# EAGLE board NHK2016mother_rev4 (EAGLE 6.2)
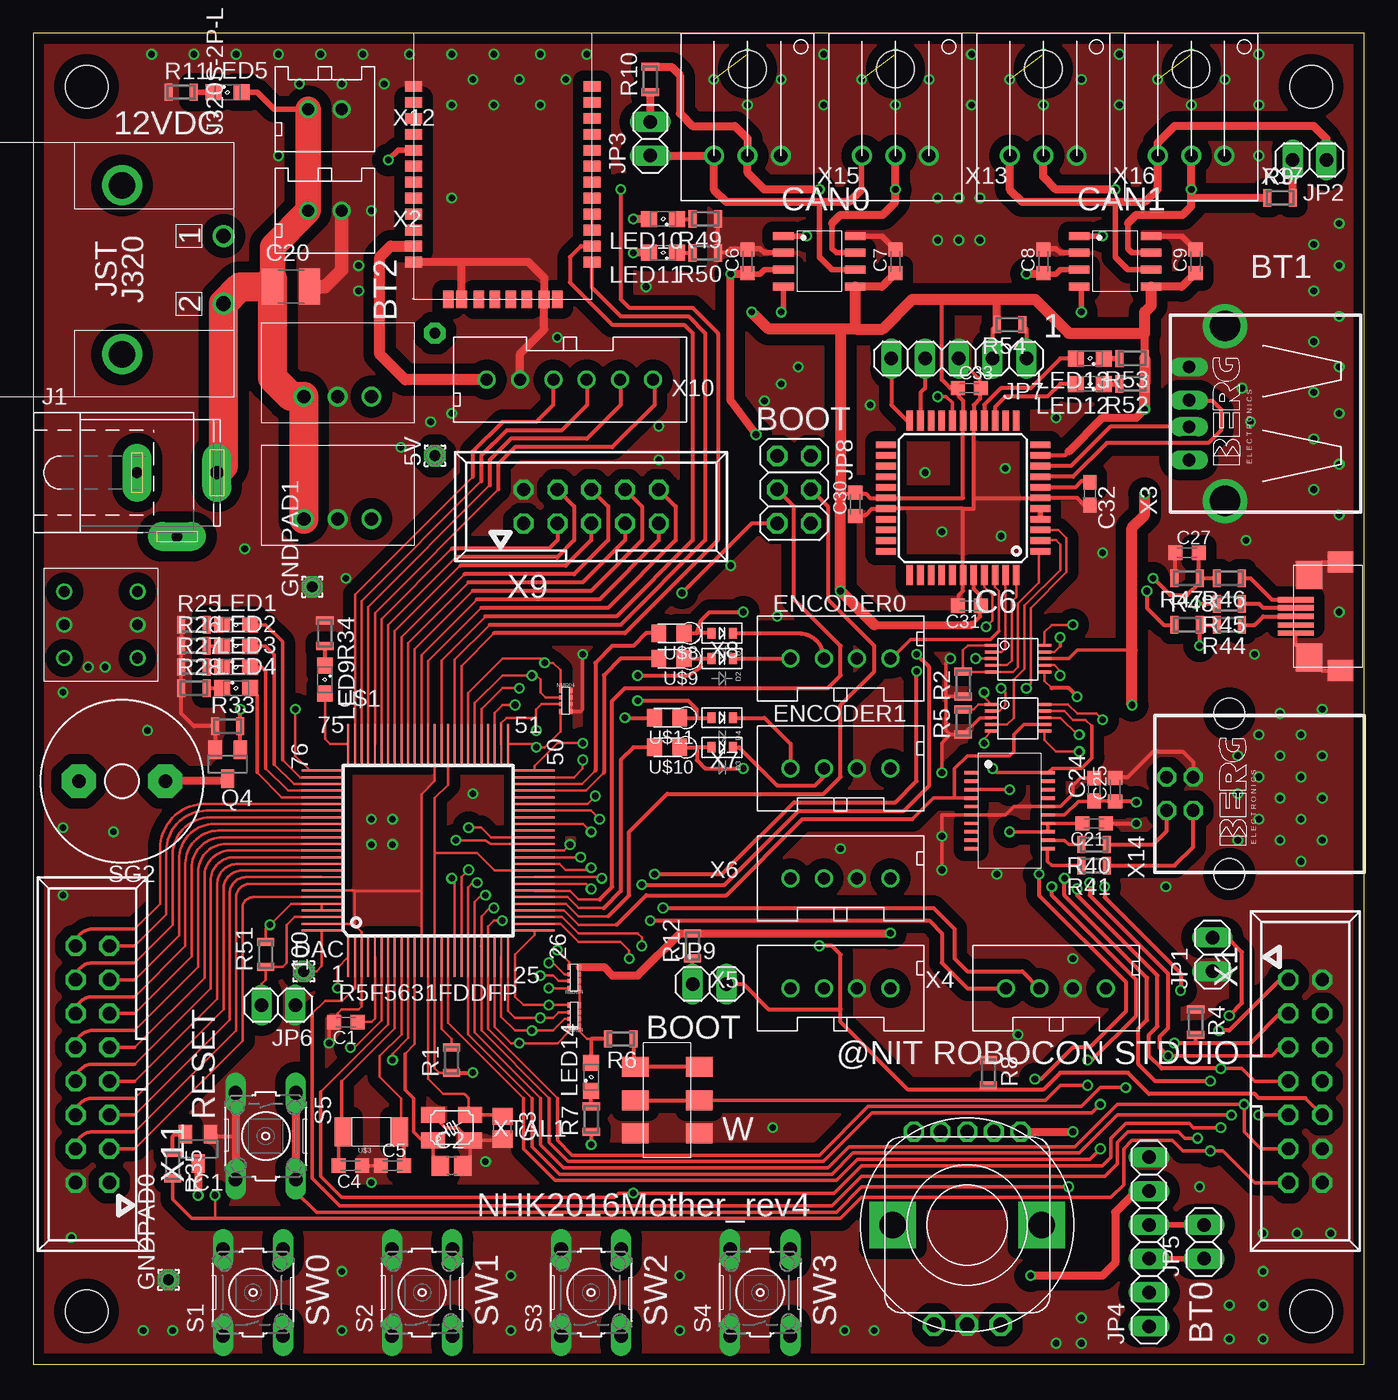
[diagram p2: board, top side]
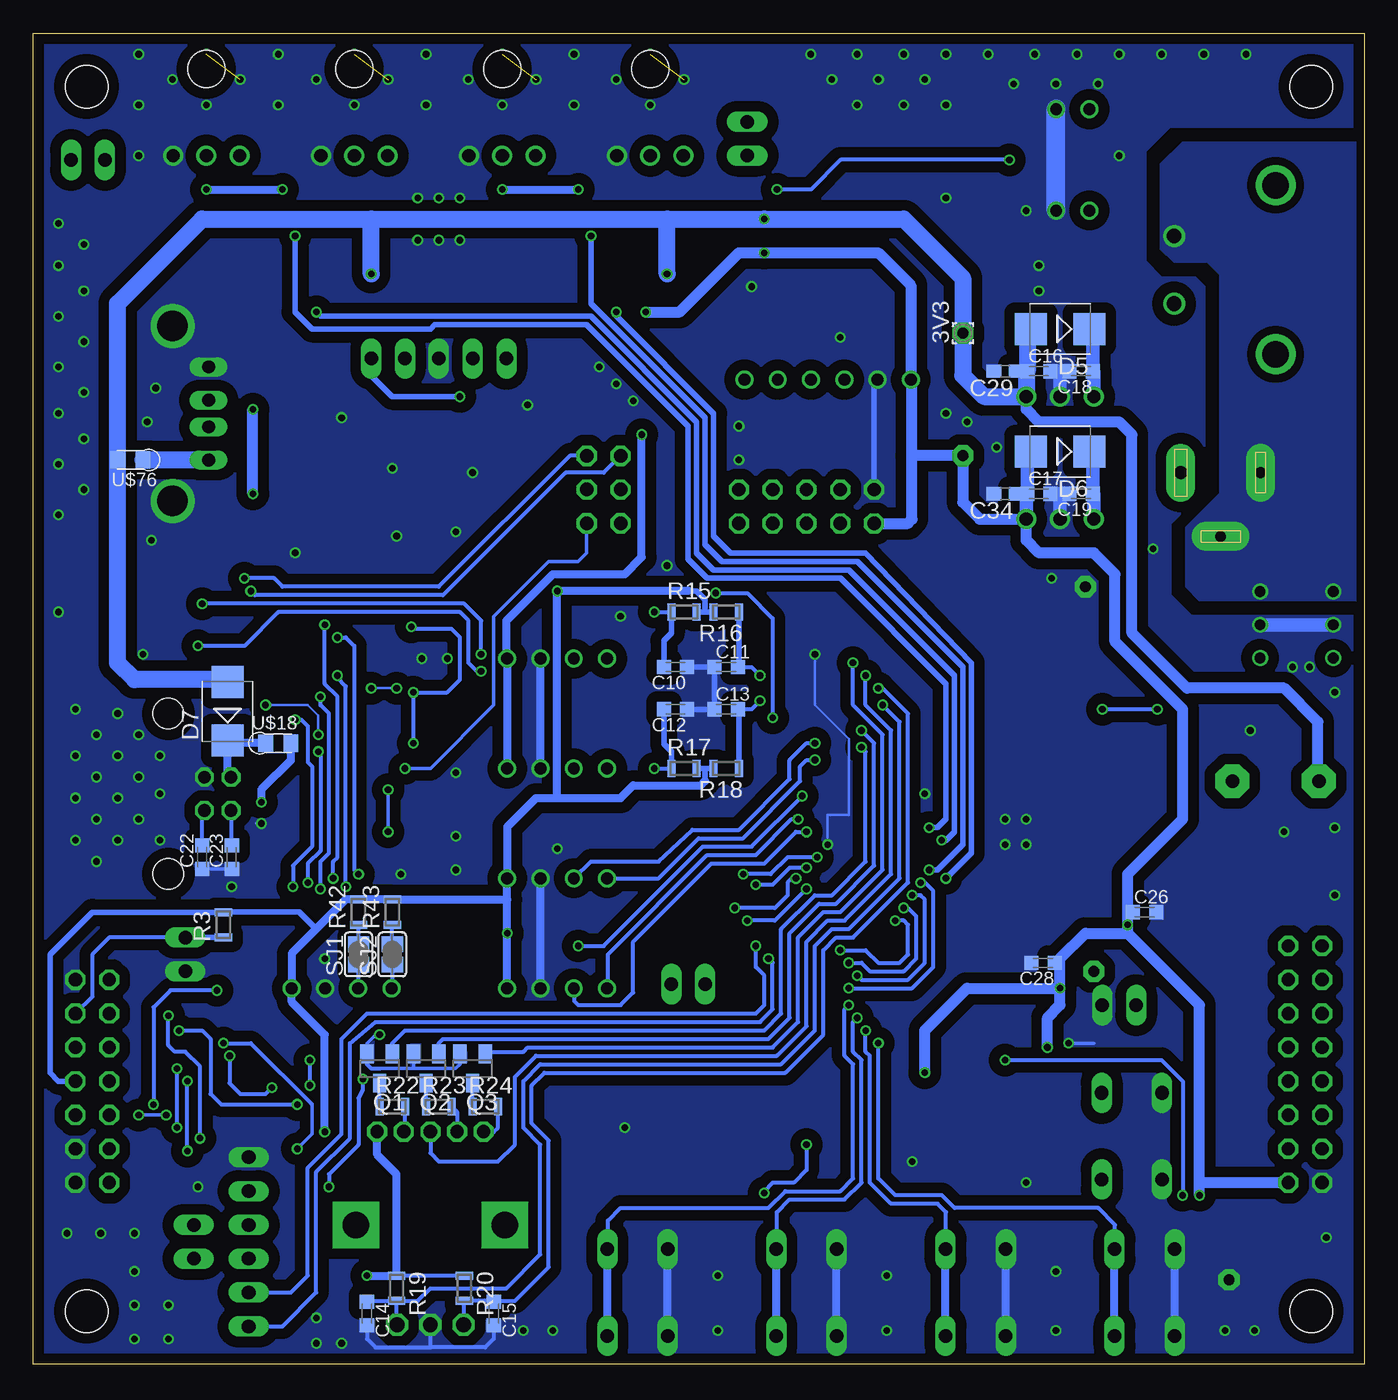
[diagram p3: board, bottom side, seen from below]

Size 100 x 100 mm. Coordinates in mm from the lower left corner, seen from the top.
Outline: 0,0 100,0 100,100 0,100 0,0
Copper layers (1*16): Top 0.035mm / dielectric 1.6mm / Bottom 0.035mm
Design rules: minimum track width 6mil, minimum drill 12mil, track to track 6mil, track to pad 6mil, pad to pad 6mil, via to via 8mil, smd to smd 0mil, copper to edge 20mil, drill to drill 10mil, minimum pad ring 6mil, minimum via ring 6mil, stop-mask expansion 0mil, vias tented up to drill 100mil, thermal gap 10mil
Holes 3.2 mm at 4,96 96,96 4,4 96,4

## Footprints (pad centres in the part's own frame; a part is rotated, then mirrored left to right if it is on the bottom)
1,6/0,8 = drill 0.813 pad 1.6 octagon: 1 0,0
C0603K = smd 1.05 x 1.08: 1 -0.875,0; 2 0.875,0
C2012 = smd 1.3 x 1.5: 1 -0.85,0; 2 0.85,0
C3225 = smd 1.6 x 2.7: 1 -1.4,0; 2 1.4,0
C1608 = smd 1.1 x 1: 1 -0.85,0; 2 0.85,0
SOD-523 = smd 0.8 x 0.6: A 0,-0.8; K 0,0.8
SMB = smd 2.4 x 2.4: A 2.2,0; C -2.2,0
SSOP20 = smd 0.254 x 1.041: 1 -2.857,-2.883; 2 -2.223,-2.883; 3 -1.587,-2.883; 4 -0.953,-2.883; 5 -0.318,-2.883; 6 0.318,-2.883; 7 0.953,-2.883; 8 1.587,-2.883; 9 2.223,-2.883; 10 2.857,-2.883; 11 2.857,2.883; 12 2.223,2.883; 13 1.587,2.883; 14 0.953,2.883; 15 0.318,2.883; 16 -0.318,2.883; 17 -0.953,2.883; 18 -1.587,2.883; 19 -2.223,2.883; 20 -2.857,2.883
SOT23B-3 = smd 1 x 1.4: 1 -0.95,-1.1; 2 0.95,-1.1; 3 0,1.1
TQFP44 = smd 1.5 x 0.5: 1 -5.8,4; 2 -5.8,3.2; 3 -5.8,2.4; 4 -5.8,1.6; 5 -5.8,0.8; 6 -5.8,0; 7 -5.8,-0.8; 8 -5.8,-1.6; 9 -5.8,-2.4; 10 -5.8,-3.2; 11 -5.8,-4; 23 5.8,-4; 24 5.8,-3.2; 25 5.8,-2.4; 26 5.8,-1.6; 27 5.8,-0.8; 28 5.8,0; 29 5.8,0.8; 30 5.8,1.6; 31 5.8,2.4; 32 5.8,3.2; 33 5.8,4 | smd 0.5 x 1.5: 12 -4,-5.8; 13 -3.2,-5.8; 14 -2.4,-5.8; 15 -1.6,-5.8; 16 -0.8,-5.8; 17 0,-5.8; 18 0.8,-5.8; 19 1.6,-5.8; 20 2.4,-5.8; 21 3.2,-5.8; 22 4,-5.8; 34 4,5.8; 35 3.2,5.8; 36 2.4,5.8; 37 1.6,5.8; 38 0.8,5.8; 39 0,5.8; 40 -0.8,5.8; 41 -1.6,5.8; 42 -2.4,5.8; 43 -3.2,5.8; 44 -4,5.8
SPC4078 = drill 0.8 pad 2.184 long: 1 -3,0; 2 0,-4.8 | drill 1 pad 2.184 long: 3 3,0
1X02 = drill 1.016 long: 1 -1.27,0; 2 1.27,0
1X06 = drill 1.016 long: 1 -6.35,0; 2 -3.81,0; 3 -1.27,0; 4 1.27,0; 5 3.81,0; 6 6.35,0
1X05 = drill 1.016 long: 1 -5.08,0; 2 -2.54,0; 3 0,0; 4 2.54,0; 5 5.08,0
2X03 = drill 1.016 octagon: 1 -2.54,-1.27; 2 -2.54,1.27; 3 0,-1.27; 4 0,1.27; 5 2.54,-1.27; 6 2.54,1.27
SML0805 = smd 1.2 x 1.2: A 1.05,0; C -1.05,0
SOT23 = smd 1 x 1.4: 1 -0.95,-1.1; 2 0.95,-1.1; 3 0,1.1
MINI_MELF-0102W = smd 0.6 x 1.3: 1 -0.95,0; 2 0.95,0
B3F-10XX = drill 1.016 long: 1 -3.251,2.261; 2 3.251,2.261; 3 -3.251,-2.261; 4 3.251,-2.261
AL60P = drill 1.016 pad 2.54 octagon: 1 -3.251,0; 2 3.251,0
SJ = smd 1.168 x 1.6: 1 -0.762,0; 2 0.762,0
LQFP100 = smd 0.15 x 3: 1 -6.5,-7.5; 2 -6,-7.5; 3 -5.5,-7.5; 4 -5,-7.5; 5 -4.5,-7.5; 6 -4,-7.5; 7 -3.5,-7.5; 8 -3,-7.5; 9 -2.5,-7.5; 10 -2,-7.5; 11 -1.5,-7.5; 12 -1,-7.5; 13 -0.5,-7.5; 14 0,-7.5; 15 0.5,-7.5; 16 1,-7.5; 17 1.5,-7.5; 18 2,-7.5; 19 2.5,-7.5; 20 3,-7.5; 21 3.5,-7.5; 22 4,-7.5; 23 4.5,-7.5; 24 5,-7.5; 25 5.5,-7.5; 51 5.5,8.5; 52 5,8.5; 53 4.5,8.5; 54 4,8.5; 55 3.5,8.5; 56 3,8.5; 57 2.5,8.5; 58 2,8.5; 59 1.5,8.5; 60 1,8.5; 61 0.5,8.5; 62 0,8.5; 63 -0.5,8.5; 64 -1,8.5; 65 -1.5,8.5; 66 -2,8.5; 67 -2.5,8.5; 68 -3,8.5; 69 -3.5,8.5; 70 -4,8.5; 71 -4.5,8.5; 72 -5,8.5; 73 -5.5,8.5; 74 -6,8.5; 75 -6.5,8.5 | smd 3 x 0.15: 26 7.5,-5.5; 27 7.5,-5; 28 7.5,-4.5; 29 7.5,-4; 30 7.5,-3.5; 31 7.5,-3; 32 7.5,-2.5; 33 7.5,-2; 34 7.5,-1.5; 35 7.5,-1; 36 7.5,-0.5; 37 7.5,0; 38 7.5,0.5; 39 7.5,1; 40 7.5,1.5; 41 7.5,2; 42 7.5,2.5; 43 7.5,3; 44 7.5,3.5; 45 7.5,4; 46 7.5,4.5; 47 7.5,5; 48 7.5,5.5; 49 7.5,6; 50 7.5,6.5; 76 -8.5,6.5; 77 -8.5,6; 78 -8.5,5.5; 79 -8.5,5; 80 -8.5,4.5; 81 -8.5,4; 82 -8.5,3.5; 83 -8.5,3; 84 -8.5,2.5; 85 -8.5,2; 86 -8.5,1.5; 87 -8.5,1; 88 -8.5,0.5; 89 -8.5,0; 90 -8.5,-0.5; 91 -8.5,-1; 92 -8.5,-1.5; 93 -8.5,-2; 94 -8.5,-2.5; 95 -8.5,-3; 96 -8.5,-3.5; 97 -8.5,-4; 98 -8.5,-4.5; 99 -8.5,-5; 100 -8.5,-5.5
FC-255 = smd 1.3 x 2.2: 1 -2.1,0; 2 2.1,0
MCP2562 = smd 1.55 x 0.6: 1 -2.7,2.54; 2 -2.7,1.27; 3 -2.7,0; 4 -2.7,-1.27; 5 2.7,-1.27; 6 2.7,0; 7 2.7,1.27; 8 2.7,2.54
2012 = smd 1.1 x 1.3: 1 -0.95,0; 2 0.95,0
RN42 = smd 1.3 x 0.8: 1 0,16; 2 0,14.8; 3 0,13.6; 4 0,12.4; 5 0,11.2; 6 0,10; 7 0,8.8; 8 0,7.6; 9 0,6.4; 10 0,5.2; 11 0,4; 12 0,2.8; 13 13.4,2.8; 14 13.4,4; 15 13.4,5.2; 16 13.4,6.4; 17 13.4,7.6; 18 13.4,8.8; 19 13.4,10; 20 13.4,11.2; 21 13.4,12.4; 22 13.4,13.6; 23 13.4,14.8; 24 13.4,16 | smd 0.8 x 1.3: 28 9.8,0; 29 3.6,0; 30 10.8,0; 31 8.5,0; 32 7.3,0; 33 6.1,0; 34 4.9,0; 35 2.6,0
M78AR033-0.5V = drill 1: 1 -2.54,0; 2 0,0; 3 2.54,0
J320S-2P-L = drill 1.1: 1 -2.54,0; 2 2.54,0 | drill 2 pad 3: P$1 -6.35,7.62; P$2 6.35,7.62
PS-85S = drill 0.8: 1 -2.5,-2.75; 2 0,-2.75; 3 2.5,-2.75; 4 -2.5,2.75; 5 0,2.75; 6 2.5,2.75
MNR04 = smd 0.4 x 0.2: 1 -0.8,0.4; 2 -0.8,-0.4; 7 0.8,0.4; 8 0.8,-0.4 | smd 0.3 x 0.2: 3 -0.25,0.4; 4 -0.25,-0.4; 5 0.25,0.4; 6 0.25,-0.4
ZX62R = smd 0.4 x 2.7: 1 1.25,1.35; 2 0.65,1.35; 3 0,1.35; 4 -0.65,1.35; 5 -1.25,1.35 | smd 1.55 x 1.9: SHLD1 -4.075,-2; SHLD4 4.075,-2 | smd 2.1 x 2: SHLD2 -3.1,0.35; SHLD3 3.1,0.35
MULTIPLEXER2CIR = smd 0.22 x 1: 1 -1,-2; 2 -0.5,-2; 3 0,-2; 4 0.5,-2; 5 1,-2; 6 -1,2; 7 -0.5,2; 8 0,2; 9 0.5,2; 10 1,2
EC12PLRGBSDVBF = drill 1 pad 1.422 octagon: 1 -4,7; 2 -2,7; 3 0,7; 4 2,7; 5 4,7 | drill 1.1 pad 1.676 octagon: 6 2.5,-7.5; 7 0,-7.5; 8 -2.5,-7.5 | drill 2 pad 3.5 square: P$9 -5.6,0; P$10 5.6,0
SSSS2 = smd 1.5 x 2: 1 -2.5,2.4; 2 0,2.4; 3 2.5,2.4; 4 -2.5,-2.4; 5 0,-2.4; 6 2.5,-2.4
057-014-1 = drill 1 octagon: 1 -7.62,-1.27; 2 -7.62,1.27; 3 -5.08,-1.27; 4 -5.08,1.27; 5 -2.54,-1.27; 6 -2.54,1.27; 7 0,-1.27; 8 0,1.27; 9 2.54,-1.27; 10 2.54,1.27; 11 5.08,-1.27; 12 5.08,1.27; 13 7.62,-1.27; 14 7.62,1.27
XA-2P = drill 0.9: 1 -1.25,0; 2 1.25,0
PN87520-S = drill 0.95 long: 1 -3.5,2.71; 2 -1,2.71; 3 1,2.71; 4 3.5,2.71 | drill 2.3 pad 2.9: S1 -6.57,0; S2 6.57,0
XA-4P = drill 0.9: 1 -3.75,0; 2 -1.25,0; 3 1.25,0; 4 3.75,0
057-010-1 = drill 1 octagon: 1 -5.08,-1.27; 2 -5.08,1.27; 3 -2.54,-1.27; 4 -2.54,1.27; 5 0,-1.27; 6 0,1.27; 7 2.54,-1.27; 8 2.54,1.27; 9 5.08,-1.27; 10 5.08,1.27
XA-6P = drill 0.9: 1 -6.25,0; 2 -3.75,0; 3 -1.25,0; 4 1.25,0; 5 3.75,0; 6 6.25,0
057-016-1 = drill 1 octagon: 1 -8.89,-1.27; 2 -8.89,1.27; 3 -6.35,-1.27; 4 -6.35,1.27; 5 -3.81,-1.27; 6 -3.81,1.27; 7 -1.27,-1.27; 8 -1.27,1.27; 9 1.27,-1.27; 10 1.27,1.27; 11 3.81,-1.27; 12 3.81,1.27; 13 6.35,-1.27; 14 6.35,1.27; 15 8.89,-1.27; 16 8.89,1.27
XA-3P-L = drill 1: 1 2.5,0; 2 0,0; 3 -2.5,0 | hole 2.8: 0,6.5
PN61729 = drill 0.95 octagon: 1 1.25,4.71; 2 -1.25,4.71; 3 -1.25,2.71; 4 1.25,2.71 | hole 2.3: -6.02,0; 6.02,0
FA-238V_CRYSTAL = smd 1.8 x 1.2: 1 -1.4,-0.95; 2 1.4,-0.95; 3 1.4,0.95; 4 -1.4,0.95

## Placement (x,y rotation side)
3V3  [1,6/0,8]  30.16,77.47 90 bottom
5V  [1,6/0,8]  30.16,68.26 90 top
C1  0.1u  [C0603K]  23.5,25.72 180 top
C2  22p  [C2012]  31.43,14.92 0 top
C3  22p  [C2012]  35.24,17.78 270 top
C4  15p  [C0603K]  23.81,14.92 180 top
C5  15p  [C0603K]  26.99,14.92 0 top
C6  0.1u  [C0603K]  53.66,82.87 90 top
C7  0.1u  [C0603K]  64.77,82.87 90 top
C8  0.1u  [C0603K]  75.88,82.87 90 top
C9  0.1u  [C0603K]  87.31,82.87 90 top
C10  0.01u  [C0603K]  51.75,52.39 180 bottom
C11  0.01u  [C0603K]  47.94,52.39 0 bottom
C12  0.01u  [C0603K]  51.75,49.21 180 bottom
C13  0.01u  [C0603K]  47.94,49.21 0 bottom
C14  0.1u  [C0603K]  74.93,3.81 270 bottom
C15  0.1u  [C0603K]  65.41,3.81 270 bottom
C16  0.1u  [C0603K]  24.45,74.61 0 bottom
C17  0.1u  [C0603K]  24.45,65.41 0 bottom
C18  0.1u  [C0603K]  21.27,74.61 180 bottom
C19  0.1u  [C0603K]  21.27,65.41 180 bottom
C20  47u  [C3225]  19.37,80.96 0 top
C21  0.1u  [C0603K]  79.69,40.64 180 top
C22  47p  [C0603K]  87.31,38.1 90 bottom
C23  47p  [C0603K]  85.09,38.1 90 bottom
C24  10u  [C1608]  79.69,43.18 90 top
C25  0.1u  [C0603K]  81.28,43.18 90 top
C26  0.1u  [C0603K]  16.51,33.97 0 bottom
C27  1u  [C0603K]  86.68,60.96 0 top
C28  0.1u  [C0603K]  24.13,30.16 180 bottom
C29  10u  [C1608]  26.99,74.61 180 bottom
C30  0.1u  [C0603K]  61.75,64.61 90 top
C31  0.1u  [C0603K]  70.33,56.99 180 top
C32  10u  [C1608]  79.38,65.41 270 top
C33  0.1u  [C0603K]  70.33,73.34 0 top
C34  10u  [C1608]  26.99,65.41 180 bottom
D1  [SOD-523]  51.75,54.93 270 top
D2  [SOD-523]  51.75,53.02 270 top
D3  [SOD-523]  51.75,46.35 270 top
D4  [SOD-523]  51.75,48.58 270 top
D5  ES2D  [SMB]  22.86,77.79 180 bottom
D6  ES2D  [SMB]  22.86,68.58 180 bottom
D7  ES2D  [SMB]  85.41,49.05 90 bottom
DAC  [1,6/0,8]  20.32,29.53 0 top
FT231XS  FT231X  [SSOP20]  73.34,41.59 270 top
GNDPAD0  [1,6/0,8]  10.16,6.35 90 top
GNDPAD1  [1,6/0,8]  20.95,58.42 90 top
IC1  [SOT23B-3]  12.38,16.19 180 top
IC6  PIC24FJ64GA004  [TQFP44]  69.85,65.09 180 top
J1  [SPC4078]  10.79,66.99 0 top
JP1  [1X02]  88.58,30.8 90 top
JP2  [1X02]  95.89,90.49 180 top
JP3  [1X02]  46.35,92.08 90 top
JP4  [1X06]  83.82,9.21 90 top
JP5  [1X02]  87.95,9.21 90 top
JP6  [1X02]  18.41,26.99 180 top
JP7  [1X05]  69.53,75.56 180 top
JP8  [2X03]  57.15,65.72 270 top
JP9  [1X02]  50.8,28.57 0 top
LED1  [SML0805]  15.24,55.56 0 top
LED2  [SML0805]  15.24,53.98 0 top
LED3  [SML0805]  15.24,52.39 0 top
LED4  [SML0805]  15.24,50.8 0 top
LED5  [SML0805]  14.61,95.57 0 top
LED9  [SML0805]  21.91,51.44 270 top
LED10  [SML0805]  47.31,86.04 180 top
LED11  [SML0805]  47.31,83.5 180 top
LED12  [SML0805]  79.38,73.66 180 top
LED13  [SML0805]  79.38,75.56 180 top
LED14  [SML0805]  41.91,21.59 90 top
Q1  [SOT23]  73.98,22.23 180 bottom
Q2  [SOT23]  70.48,22.23 180 bottom
Q3  [SOT23]  66.99,22.23 180 bottom
Q4  [SOT23]  14.61,45.09 180 top
R1  10k  [MINI_MELF-0102W]  31.43,22.86 90 top
R2  10k  [MINI_MELF-0102W]  69.85,51.12 90 top
R3  10k  [MINI_MELF-0102W]  85.72,33.02 90 bottom
R4  10k  [MINI_MELF-0102W]  87.31,25.72 270 top
R5  10k  [MINI_MELF-0102W]  69.85,48.26 90 top
R6  10k  [MINI_MELF-0102W]  44.13,24.45 180 top
R7  1k  [MINI_MELF-0102W]  41.91,18.41 90 top
R8  10k  [MINI_MELF-0102W]  71.75,21.91 270 top
R9  120  [MINI_MELF-0102W]  93.66,87.63 0 top
R10  120  [MINI_MELF-0102W]  46.35,96.52 90 top
R11  1k  [MINI_MELF-0102W]  11.11,95.57 0 top
R12  10k  [MINI_MELF-0102W]  49.53,31.43 90 top
R15  200  [MINI_MELF-0102W]  51.12,56.52 0 bottom
R16  200  [MINI_MELF-0102W]  47.94,56.52 180 bottom
R17  200  [MINI_MELF-0102W]  51.12,44.77 0 bottom
R18  200  [MINI_MELF-0102W]  47.94,44.77 180 bottom
R19  10k  [MINI_MELF-0102W]  72.71,5.71 270 bottom
R20  10k  [MINI_MELF-0102W]  67.63,5.71 270 bottom
R22  10k  [MINI_MELF-0102W]  73.03,19.37 0 bottom
R23  10k  [MINI_MELF-0102W]  69.53,19.37 0 bottom
R24  10k  [MINI_MELF-0102W]  66.04,19.37 0 bottom
R25  1k  [MINI_MELF-0102W]  12.06,55.56 0 top
R26  1k  [MINI_MELF-0102W]  12.06,53.98 0 top
R27  1k  [MINI_MELF-0102W]  12.06,52.39 0 top
R28  1k  [MINI_MELF-0102W]  12.06,50.8 0 top
R33  10k  [MINI_MELF-0102W]  14.61,47.94 0 top
R34  1k  [MINI_MELF-0102W]  21.91,54.93 270 top
R35  2k  [MINI_MELF-0102W]  10.48,14.92 270 top
R40  27  [MINI_MELF-0102W]  79.69,39.05 180 top
R41  27  [MINI_MELF-0102W]  79.69,37.47 180 top
R42  1k  [MINI_MELF-0102W]  75.56,33.97 90 bottom
R43  1k  [MINI_MELF-0102W]  73.03,33.97 90 bottom
R44  22  [MINI_MELF-0102W]  89.85,55.56 180 top
R45  22  [MINI_MELF-0102W]  89.85,57.15 180 top
R46  15k  [MINI_MELF-0102W]  89.85,59.05 180 top
R47  30k  [MINI_MELF-0102W]  86.68,59.05 180 top
R48  1.5k  [MINI_MELF-0102W]  86.68,55.56 0 top
R49  1k  [MINI_MELF-0102W]  50.48,86.04 180 top
R50  1k  [MINI_MELF-0102W]  50.48,83.5 180 top
R51  10k  [MINI_MELF-0102W]  17.46,30.8 90 top
R52  1k  [MINI_MELF-0102W]  82.55,73.66 180 top
R53  1k  [MINI_MELF-0102W]  82.55,75.56 180 top
R54  10k  [MINI_MELF-0102W]  73.34,78.11 180 top
S1  [B3F-10XX]  16.51,5.4 90 top
S2  [B3F-10XX]  29.21,5.4 90 top
S3  [B3F-10XX]  41.91,5.4 90 top
S4  [B3F-10XX]  54.61,5.4 90 top
S5  [B3F-10XX]  17.46,17.14 270 top
SG2  AL60P  [AL60P]  6.67,43.81 180 top
SJ1  [SJ]  75.56,30.8 90 bottom
SJ2  [SJ]  73.03,30.8 90 bottom
U$1  R5F5631FDDFP  [LQFP100]  30.16,38.1 0 top
U$3  FC-255  [FC-255]  25.4,17.46 0 top
U$4  MCP2562  [MCP2562]  81.28,82.23 0 top
U$5  MCP2562  [MCP2562]  59.05,82.23 0 top
U$8  FB1.25MM 330  [2012]  47.94,54.93 180 top
U$9  FB1.25MM 330  [2012]  47.94,53.02 180 top
U$10  FB1.25MM 330  [2012]  47.62,46.35 180 top
U$11  FB1.25MM 330  [2012]  47.62,48.58 180 top
U$12  RN42  [RN42]  28.57,80.01 0 top
U$13  M78AR033-0.5  [M78AR033-0.5V]  22.86,72.71 0 top
U$14  M78AR033-0.5  [M78AR033-0.5V]  22.86,63.5 0 top
U$15  J320S-2P-L  [J320S-2P-L]  14.29,82.23 90 top
U$16  PS-85S  [PS-85S]  5.08,55.56 270 top
U$17  NMR04  [MNR04]  40.01,49.85 270 top
U$18  FB1.25MM 330  [2012]  81.6,46.67 0 bottom
U$21  NMR04  [MNR04]  40.64,26.19 90 top
U$22  ZX62R  [ZX62R]  96.2,56.2 90 top
U$23  NMR04  [MNR04]  40.64,29.05 90 top
U$24  MULTIPLEXER2CIR  [MULTIPLEXER2CIR]  73.98,53.02 270 top
U$25  MULTIPLEXER2CIR  [MULTIPLEXER2CIR]  73.98,48.58 270 top
U$58  EC12PLRGBSDVBF  [EC12PLRGBSDVBF]  70.17,10.48 0 top
U$76  FB1.25MM  [2012]  92.71,67.94 180 bottom
U$82  SSSS2  [SSSS2]  47.62,19.84 90 top
X1  057-014-1  [057-014-1]  95.57,21.27 270 top
X2  XA-2P  [XA-2P]  21.91,86.68 0 top
X3  PN87520-S  [PN87520-S]  89.53,71.44 90 top
X4  XA-4PNORMAL  [XA-4P]  76.83,28.26 180 top
X5  XA-4PNORMAL  [XA-4P]  60.64,28.26 180 top
X6  XA-4PNORMAL  [XA-4P]  60.64,36.51 180 top
X7  XA-4PNORMAL  [XA-4P]  60.64,44.77 180 top
X8  XA-4PNORMAL  [XA-4P]  60.64,53.02 180 top
X9  057-010-1  [057-010-1]  41.91,64.45 0 top
X10  XA-6P  [XA-6P]  40.32,73.98 0 top
X11  057-016-1  [057-016-1]  4.45,22.54 90 top
X12  XA-2P  [XA-2P]  21.91,94.3 0 top
X13  XA-3PL  [XA-3P-L]  64.77,90.81 0 top
X14  [PN61729]  89.85,42.86 90 top
X15  XA-3PL  [XA-3P-L]  53.66,90.81 0 top
X16  XA-3PL  [XA-3P-L]  75.88,90.81 0 top
X17  XA-3PL  [XA-3P-L]  87,90.81 0 top
XTAL1  FA-238V_CRYSTAL  [FA-238V_CRYSTAL]  31.43,17.78 0 top

## Tracks (layer width: path | path; a pad name or v marks a point on that pad's centre or on a via)
12V-
  pour Bottom (isolate 0.61, no thermals): 0,57.47 12.38,57.47 13.34,58.42 13.34,62.87 10.79,65.41 10.79,81.92 11.75,82.87 14.29,82.87 15.24,83.82 15.24,90.17 13.65,91.76 0,91.76
+3V3  (via drill 0.5)
  Top 0.2: U$23.8 U$23.6 U$23.4 U$23.2 U$21.8 U$21.6 U$21.4 U$21.2 41.04,25 41.59,24.45 41.91,24.45 | U$1.97 U$1.96 19.36,34.6 v17.78,33.02 17.46,32.7 R51.2 | 30.16,38.42 33.34,38.42 34.66,37.1 U$1.35 | 30.16,38.42 30.16,42.55 31.16,43.55 U$1.60 | U$1.1 22.86,29.8 v22.86,28.26 | 30.16,38.42 U$1.14 30.16,22.23 30.48,21.91 R1.1 31.75,21.91 | v23.81,23.81 24.13,23.81 26.16,25.84 U$1.6 | U$25.8 77.15,48.58 78.42,47.31 v78.58,47.31
  Top 0.254: U$24.8 77.79,53.02 78.42,53.66 82.55,53.66
  Top 0.305: R54.2 72.07,77.78 JP7.2 | C33.1 69.53,73.27 | 69.53,73.27 69.53,72.71 69.85,72.39 IC6.17 69.85,65.09 IC6.28 62.87,65.09 62.55,65.41 61.84,65.41 C30.2 | C31.1 71.12,57.07 71.12,57.78 70.65,58.26 IC6.40 | R6.2 41.91,24.45 LED14.A | 31.75,21.91 v33.02,21.91 | 77.79,68.58 77.5,68.29 IC6.10 | 69.53,73.27 C33.1 68.9,73.34 68.26,73.98 68.26,80.01 | 60.64,65.41 61.59,65.41 | 70.48,55.56 71.12,56.2 71.12,56.83 | R12.2
  Top 0.406: R53.1 | U$23.8
  Top 0.61: C7.1 63.74,80.96 U$5.5 | C9.1 86.28,80.96 U$4.5 | R53.1 83.5,77.47 | LED11.A v45.09,83.5 | 72.39,80.01 72.39,77.78 R54.2 | IC1.3 v12.38,12.7 | 77.79,68.58 80.33,71.12 82.87,71.12 v83.5,71.75 | 63.18,55.56 70.48,55.56 | U$23.8 42.86,29.84 43.5,29.21 45.4,29.21 48.58,32.38 R12.2 v64.39,32.38 | U$58.5 74.18,17.46 v78.11,17.46 | JP4.5 82.87,13.02 81.28,11.43 81.28,7.62 80.33,6.67 v74.93,6.67 | C31.1 71.12,56.91 71.12,56.83
  Top 0.813: R53.1 R52.1 v83.5,71.75 | U$4.5 83.98,79.53 83.5,79.06 83.5,77.47 77.79,77.47 75.25,80.01 72.39,80.01 68.26,80.01 66.04,80.01 63.82,77.79 61.76,77.79 | X10.1 27.94,73.98 26.04,75.88 26.04,83.19 26.86,84.01 U$12.11 | 61.76,77.79 60.64,77.79 | 60.64,77.79 55.24,77.79 v53.98,79.06 | 61.76,77.79 U$5.5 | 60.64,77.79 60.64,65.41 v60.64,58.1 63.18,55.56 | v83.5,65.41 83.5,63.82 82.55,62.87 82.55,53.66 v82.55,49.53
  Bottom 0.2: v78.58,47.31 78.58,48.74 79.38,49.53 v82.55,49.53
  Bottom 0.305: R20.1 R19.1
  Bottom 0.406: 49.53,56.52 R15.2 | R18.2 49.53,44.77 | 49.53,44.77 R17.2 | R16.2 49.53,56.52 | 49.53,56.52 49.53,57.47 50.16,58.1 50.8,58.1 | 49.53,43.81 49.53,44.77 | 78.58,32.86 78.9,32.86 80.01,33.97 R3.2 95.57,33.97 98.74,30.8 98.74,21.91 98.11,21.27 X1.8 | C26.1 17.78,33.97 | C28.1 23.2,30.16 23.2,30.14 22.86,30.14 22.86,30.48 | C34.1 C17.1
  Bottom 0.61: X5.1 v64.39,32.38 64.39,34.92 | 64.39,34.92 X6.1 64.39,40.38 62.23,42.55 60.64,42.55 | 49.53,43.81 49.85,43.5 54.93,43.5 55.88,42.55 60.64,42.55 | 50.8,58.1 v60.64,58.1 60.64,42.55 | 64.39,34.92 R43.2 R42.2 76.52,34.92 78.58,32.86 80.58,30.86 X4.1 80.58,27.25 78.11,24.77 v78.11,17.46 | U$58.5 74.17,15.75 72.71,14.29 R19.1 v74.93,6.67 | v83.5,65.41 v83.5,65.4
  Bottom 0.813: X9.1 34.29,63.18 33.97,63.5 33.97,68.26 arc-60 34.02,68.26 | v53.98,79.06 51.44,79.06 46.99,83.5 v45.09,83.5 36.51,83.5 34.07,81.06 X10.1 arc60 33.97,73.66 33.97,68.3 34.02,68.26 | X11.1 12.38,13.65 | 12.38,13.65 12.38,26.99 17.78,32.38 | 17.78,32.38 v17.78,33.02 17.78,33.97 17.78,36.83 13.65,40.96 13.65,49.21 18.73,54.29 18.73,59.37 20.32,60.96 24.45,60.96 25.4,61.91 U$14.3 28.89,63.5 30.16,64.77 5V.1 34.02,68.26 | v12.38,12.7 12.38,13.65 | v22.86,28.26 22.86,30.48 20.95,32.38 17.78,32.38 | v33.02,21.91 33.02,25.08 29.84,28.26 v22.86,28.26 | v23.81,23.81 23.81,26.04 22.86,26.99 v22.86,28.26 | v83.5,65.4 v83.5,71.75
  Bottom 1.016: D6.A 25.32,68.32 C17.1 25.4,65.33 U$14.3
+5V  (via drill 0.5)
  Top 0.2: 72.55,55.09 72.55,58.1 72.25,58.4 IC6.42
  Top 0.254: 72.55,55.09 71.91,54.45 65.88,54.45 64.45,53.02 X8.1
  Top 0.406: C6.1 53.73,81.92 54.61,81.92 54.93,82.23 U$5.3 | C8.1 75.96,81.92 76.83,81.92 77.15,82.23 U$4.3
  Top 0.61: LED10.A v45.09,86.04 | C6.1 53.58,81.92 v52.39,81.92 52.39,72.39 v54.29,69.85 | C8.1 75.81,81.92 v74.61,81.92
  Bottom 0.406: 25.4,74.53 25.4,74.61 | C29.1 C16.1
  Bottom 0.61: X7.1 X8.1 64.45,53.08 64.45,55.88 60.96,59.37 55.56,59.37 54.29,60.64 v54.29,69.85 | U$76.2 | D7.A 85.43,51.28 | SG2.2 3.49,43.89 | 25.4,72.39 U$13.3
  Bottom 0.813: 3.49,43.89 3.49,48.26 6.03,50.8 13.34,50.8 17.46,54.93 17.46,69.85 18.41,70.8 24.45,70.8 25.4,71.75 U$13.3
  Bottom 1.016: C16.1 25.4,74.53 | D5.A 25.32,77.53
  Bottom 1.27: 25.4,74.53 U$13.3 28.57,72.71 30.16,74.3 3V3.1 30.16,81.6 34.61,86.04 v45.09,86.04 52.39,86.04 | 25.32,77.53 C16.1 | v52.39,81.92 52.39,86.04 | U$76.2 93.66,79.69 87.31,86.04 74.61,86.04 | 85.43,51.28 85.41,51.44 92.39,51.44 93.66,52.7 93.66,53.18 93.66,56.2 U$76.2 | 74.61,86.04 52.39,86.04 | v74.61,81.92 74.61,86.04
+12V
  Top 0.406: LED5.A 16.83,95.57 18.1,94.3 X12.1
  Top 1.422: 17.97,81.6 C20.1
  Top 1.93: X12.1 X2.1 17.97,83.99 17.97,81.6
  Top 2.184: J1.3 14.29,67.48 U$15.1 15.56,80.96 C20.1 | U$14.1 U$13.1 19.37,72.71 17.97,74.11 17.97,81.6
  Bottom 1.016: D5.C 20.4,77.53 C18.1 20.32,74.53 U$13.1 | D6.C 20.4,68.32 C19.1 20.32,65.33 U$14.1
AN000
  Top 0.2: 7.62,16.19 15.72,24.29 15.72,34.29 arc-90 16.53,35.1 U$1.95
  Top 0.254: X11.3 7.62,16.19
AN001
  Top 0.2: 7.62,17.46 15.24,25.08 15.24,35.08 arc-90 16.26,36.1 U$1.93
  Top 0.254: 7.62,17.46 4.45,17.46 arc90 X11.4
AN002
  Top 0.2: 7.62,18.73 14.76,25.88 14.76,35.4 arc-90 15.96,36.6 U$1.92
  Top 0.254: X11.5 7.62,18.73
AN003
  Top 0.2: 7.62,20 14.29,26.67 14.29,35.72 arc-90 15.67,37.1 U$1.91
  Top 0.254: 7.62,20 4.45,20 arc90 X11.6
AN004
  Top 0.2: 7.62,21.27 13.81,27.46 13.81,36.04 arc-90 15.38,37.6 U$1.90
  Top 0.254: X11.7 7.62,21.27
AN005
  Top 0.2: 7.62,22.54 13.34,28.26 13.34,36.35 arc-90 15.08,38.1 U$1.89
  Top 0.254: 7.62,22.54 4.45,22.54 arc90 X11.8
AN006
  Top 0.2: 7.62,23.81 12.86,29.05 12.86,36.67 arc-90 14.79,38.6 U$1.88
  Top 0.254: X11.9 7.62,23.81
AN007
  Top 0.2: 7.62,25.08 12.38,29.84 12.38,36.99 arc-90 14.49,39.1 U$1.87
  Top 0.254: 7.62,25.08 4.45,25.08 arc90 X11.10
AN008
  Top 0.2: 7.62,26.35 11.91,30.64 11.91,37.31 arc-90 14.2,39.6 U$1.86
  Top 0.254: X11.11 7.62,26.35
AN009
  Top 0.2: U$1.85 13.91,40.1 arc90 11.43,37.62 11.43,31.43 7.62,27.62
  Top 0.254: 7.62,27.62 4.45,27.62 arc90 X11.12
AN010
  Top 0.2: U$1.84 13.61,40.6 arc90 10.95,37.94 10.95,32.23 7.62,28.89
  Top 0.254: X11.13 7.62,28.89
AN011
  Top 0.2: U$1.83 13.32,41.1 arc90 10.48,38.26 10.48,33.02 7.62,30.16
  Top 0.254: 7.62,30.16 4.45,30.16 arc90 X11.14
AN012
  Top 0.2: U$1.82 13.03,41.6 arc90 10,38.58 10,33.81 7.62,31.43
  Top 0.254: X11.15 7.62,31.43
AN013
  Top 0.2: 12.89,42.1 13.02,42.1 | 13.02,42.1 U$1.81 | 13.02,42.1 arc92 9.53,38.73 9.53,34.61 7.62,32.7
  Top 0.254: 7.62,32.7 4.45,32.7 arc90 X11.16
CANH0  (via drill 0.5 pad 0.3)
  Top 0.406: U$5.7 60.33,83.5 60.01,83.82 60.01,85.72 | R10.2
  Top 0.61: 60.01,85.72 60.64,86.36 63.82,86.36 64.77,87.31 v64.77,88.27 X13.2 | v59.05,88.27 54.93,88.27 53.66,89.53 X15.2 53.66,92.08 52.7,93.03 49.53,93.03 48.58,93.98 48.58,96.84 47.94,97.47 R10.2
  Bottom 0.61: v64.77,88.27 v59.05,88.27
CANH1  (via drill 0.5 pad 0.3)
  Top 0.406: U$4.7 82.55,83.5 82.23,83.82 82.23,85.72
  Top 0.61: 82.23,85.72 82.87,86.36 86.36,86.36 87,87 87,87.63 | 87,87.63 v87,88.27 X17.2 | v81.28,88.27 76.83,88.27 75.88,89.22 X16.2 | R9.1 87,87.63
  Bottom 0.61: v87,88.27 v81.28,88.27
CANL0
  Top 0.406: U$5.6 60.01,82.23 59.05,83.19 59.05,87.31 | 62.23,88.27 62.23,90.81 X13.3
  Top 0.61: 62.23,88.27 61.28,87.31 59.05,87.31 52.07,87.31 51.16,88.22 X15.3 JP3.1
CANL1
  Top 0.406: U$4.6 82.23,82.23 81.28,83.19 81.28,87.31 | 84.45,90.84 84.5,90.84 X17.3 84.5,90.77 84.45,90.77
  Top 0.61: 84.45,90.77 84.45,88.27 83.5,87.31 81.28,87.31 74.3,87.31 73.38,88.22 X16.3 | JP2.1 97.16,92.08 96.2,93.03 85.72,93.03 84.45,91.76 84.45,90.84
CRX0  (via drill 0.5 pad 0.3)
  Top 0.2: v31.43,36.51 31.66,36.28 U$1.17
  Top 0.406: v56.2,79.06 56.35,79.22 U$5.4
  Bottom 0.406: v31.43,36.51 29.53,38.42 29.53,52.7 37.47,60.96 47.62,60.96 48.9,62.23 48.9,71.44 56.2,78.74 v56.2,79.06
CRX1  (via drill 0.5 pad 0.3)
  Top 0.2: v31.75,39.37 33.97,39.37 34.34,39.1 U$1.39
  Top 0.406: U$4.4 78.74,80.8 v78.74,79.06
  Bottom 0.406: v78.74,79.06 78.42,78.74 58.1,78.74 50.16,70.8 50.16,60.96 48.9,59.69 38.73,59.69 30.8,51.75 30.8,40.01 31.43,39.37 v31.75,39.37
CTX0  (via drill 0.5 pad 0.3)
  Top 0.2: U$1.18 32.16,36.61 v32.7,37.15
  Top 0.406: v58.1,84.77 U$5.1
  Bottom 0.406: v32.7,37.15 32.07,37.15 30.16,39.05 30.16,52.39 38.1,60.33 48.26,60.33 49.53,61.59 49.53,71.12 58.1,79.69 v58.1,84.77
CTX1  (via drill 0.5 pad 0.3)
  Top 0.2: v32.7,40.32 33.66,40.32 34.38,39.6 U$1.40
  Top 0.406: U$4.1 v80.33,84.77
  Bottom 0.406: v80.33,84.77 80.33,79.06 79.06,77.79 70.17,77.79 69.85,78.11 58.42,78.11 50.8,70.48 50.8,60.48 49.37,59.05 39.37,59.05 31.43,51.12 31.43,40.96 32.07,40.32 v32.7,40.32
DA1
  Top 0.2: DAC.1 21.27,29.53 21.66,29.92 U$1.100
EMLE  (via drill 0.5)
  Top 0.2: 20.95,26.35 21.91,27.3 23.21,27.3 24.16,28.26 U$1.2
  Top 0.254: 20.95,26.35 20.95,13.97 23.02,11.91 60.01,11.91 62.23,14.13 80.49,14.13 81.44,15.08 81.44,16.67 82.23,17.46 86.04,17.46 86.52,16.99 v87.47,16.99
  Top 0.305: v89.85,26.19 90.81,27.15 90.81,30.96 89.69,32.07 JP1.2
  Bottom 0.305: JP1.2 94.3,32.07 95.57,30.8 95.57,27.62 X1.4 | v87.47,16.99 87.47,22.38 88.58,23.5 89.38,23.5 89.85,23.97 v89.85,26.19
  Bottom 0.406: R3.1 JP1.2
EXTAL
  Top 0.2: XTAL1.3 32.78,18.79 arc-45 32.7,18.96 32.7,20 32.46,20.25 arc45 32.28,20.32 30.8,20.32 29.66,21.45 U$1.13
  Top 0.254: C3.1 35.14,18.73 XTAL1.3
GND  (via drill 0.5)  (4 unrouted)
  Top 0.2: C1.2 22.86,26.11 22.86,26.35 23.18,26.67 24.45,26.67 24.66,26.89 U$1.3 24.66,32.49 24.13,33.02 | U$17.7 U$17.5 U$17.3 U$17.1 | U$24.3 v70.8,53.02 | 24.13,35.56 29.16,35.56 | 24.13,35.56 24.13,33.02 | v40.32,39.05 39.87,38.6 U$1.38 | 24.13,35.56 24.09,35.6 U$1.94 | 24.13,33.02 24.05,33.1 U$1.99 | U$1.62 30.16,43.81 29.16,42.81 29.16,35.56 | 29.16,35.56 U$1.12
  Top 0.254: C4.1 C5.1 | C3.2 35.14,16.83 XTAL1.2 | C2.2 32.83,15.47 XTAL1.2 | XTAL1.4 30.98,17.78 31.88,17.78 XTAL1.2 | R8.1 | C33.2 71.12,73.42 71.12,73.98 JP7.3 | v68.26,37.15 68.26,41.27 FT231XS.6 73.03,41.27 73.66,41.91 FT231XS.16 77.15,41.91 78.11,42.86 78.11,43.5 78.66,44.05 79.69,44.05 C24.2 | U$25.3 71.12,48.58 R5.1 68.89,47.31 | R2.1 68.58,50.16 | 68.58,50.16 68.58,47.62 68.89,47.31 | v68.9,53.02 68.58,52.7 68.58,50.16 | 68.89,47.31 68.26,46.68 v68.26,44.45 | C1.2 22.54,25.72 22.23,25.4 v22.23,24.13 | U$17.7 41.11,49.05 41.27,49.21 v41.27,53.34
  Top 0.305: IC1.1 13.48,17.14 15.2,17.14 | Q4.2 R33.1 12.06,47.94 11.12,48.89 R28.1 R27.1 R26.1 R25.1 | C33.2 71.12,73.11 71.12,72.55 70.65,72.08 IC6.16 70.65,65.09 | C30.1 61.84,63.82 62.55,63.82 63.02,64.29 IC6.29 69.85,64.29 | C31.2 69.53,57.07 69.53,57.78 69.85,58.1 IC6.39 69.85,64.29 | 79.61,64.45 79.06,64.45 78.42,65.09 IC6.6 70.65,65.09 | 69.85,64.29 70.65,64.29 70.65,65.09 | C21.1 v82.87,40.64 | C25.2 81.36,44.13 82.23,44.13 84.14,46.04 86.36,46.04 87.14,45.26 X14.4 | R47.2 85.8,59.13 C27.1 | U$22.5 94.85,54.1 U$22.SHLD2 96.83,52.12 U$22.SHLD1 | U$22.SHLD3 96.83,60.27 U$22.SHLD4 | R49.1 R50.1 52.07,83.5 52.39,83.82 53.58,83.82 C6.2
  Top 0.406: C6.2 53.73,83.82 54.61,83.82 54.93,83.5 U$5.2 | C7.2 63.74,84.77 U$5.8 | C8.2 75.96,83.82 76.83,83.82 77.15,83.5 U$4.2 | C9.2 86.28,84.77 U$4.8
  Top 0.61: S5.3 15.2,17.14 S5.4 | U$12.28 38.42,80.05 | 32.07,82.81 37.2,82.81 38.38,81.64 U$12.28 | 32.07,82.81 U$12.12 | U$12.29 32.17,82.7 32.07,82.81 | X10.2 36.57,75.94 38.38,77.75 U$12.28
  Top 1.016: C20.2 21.91,80.96 23.16,82.21 X2.2
  Bottom 0.2: v70.8,53.02 71.12,53.02 | v40.32,39.05 40.32,41.27 38.73,41.27 38.73,46.99 41.27,49.53 v41.27,53.34
  Bottom 0.254: C23.1 C22.1 | Q3.2 67.94,22.54 68.26,22.23 71.44,22.23 | 71.44,22.23 73.98,22.23 | Q2.2 71.44,22.23 | v73.98,24.77 74.3,24.77 74.93,24.13 74.93,23.18 | v22.23,24.13 20.32,24.13
  Bottom 0.305: Q1.2 74.93,23.18 74.93,22.54 74.61,22.23 73.98,22.23 | C15.2 65.41,1.91 66.04,1.27 70.17,1.27 | 70.17,1.27 U$58.7 | C14.2 74.93,1.91 74.3,1.27 70.17,1.27 | v82.87,40.64 83.19,40.64
  Bottom 0.406: C10.1 C11.1 C13.1 C12.1 | X9.2 36.83,73.72 X10.2
  Bottom 0.61: S1.1 S1.2 | S2.1 S2.2 | S3.1 S3.2 | S4.1 S4.2 | X5.2 X6.2 | X7.2 X8.2
  Bottom 1.016: C18.2 22.86,74.61 | 22.86,74.61 C16.2 | U$13.2 22.86,74.61 | C19.2 22.86,65.41 | 22.86,65.41 C17.2 | U$14.2 22.86,65.41 | U$16.2 U$16.5
  Bottom 1.422: X2.2 X12.2
  other vias: 25.4,13.65 33.97,15.24 60.64,38.73 78.11,30.48 85.09,35.88 95.25,37.78 52.39,60.01 55.88,56.2 46.04,80.96 31.43,87.63 38.1,98.42 31.43,98.42 8.89,98.42 15.24,98.42 24.45,82.55 24.45,80.64 25.4,86.68 6.03,40.01 8.57,47.62 8.26,2.54 23.18,6.99 35.88,6.67 48.58,6.67 72.39,36.83 95.25,40.96 96.84,42.55 96.84,39.37 92.08,40.96 98.11,56.52 98.11,67.63 91.12,61.91 96.84,49.21 80.33,60.96 66.99,66.99 73.03,67.31 72.71,62.23 68.26,62.55 62.87,72.07 56.2,73.66 69.53,84.45 69.53,87.63 53.66,94.61 64.77,94.61 64.77,98.42 62.23,96.52 51.12,96.52 56.2,96.52 59.37,94.61 70.48,94.61 70.48,98.42 96.2,84.14 96.2,80.64 96.2,76.83 98.11,74.93 98.11,71.44 90.81,73.34 60.96,2.54 78.74,3.49 92.39,9.84 87.63,13.34 89.85,4.45 25.4,40.96 26.99,40.96 25.4,39.05 26.99,39.05 91.76,53.34 93.66,48.9 93.66,42.55 91.44,70.8 68.26,39.69 92.39,4.45 93.66,39.37 76.83,71.12 57.47,74.93 4.13,52.39 5.4,52.39 23.5,59.05 27.62,68.9 29.84,70.8 31.43,71.44 15.88,61.28 39.37,77.15 26.35,96.2 23.18,96.2 21.59,98.42 20,96.2 18.41,90.81 46.99,67.94 46.99,70.48 54.93,72.39 33.02,42.86 12.06,98.42 18.41,98.42 24.77,98.42 28.26,98.42 34.61,98.42 41.59,98.42 53.66,98.42 67.31,96.52 59.37,98.42 73.34,96.52 98.11,85.72 98.11,78.74 96.2,73.03 96.2,69.53 96.2,65.72 92.39,6.99 92.39,1.91 89.85,1.91 78.74,1.59 76.83,1.59 63.18,2.54 48.58,2.54 35.88,2.54 23.18,2.54 10.48,2.54 2.86,9.53 2.22,35.24 2.22,40.32 2.22,50.48 55.56,17.78 67.94,87.63 71.12,87.63 67.94,84.45 71.12,84.45 94.93,9.84 97.47,9.84 95.25,44.13 96.84,45.72 93.66,45.72 92.08,44.13 95.25,47.31 92.08,47.31 90.49,45.72 90.49,42.86 90.49,39.37 33.02,96.52 36.51,96.52 40.01,96.52 31.43,94.61 34.61,94.61 38.1,94.61 75.88,98.42 75.88,94.61 78.74,96.52 81.6,94.61 81.6,98.42 84.45,96.52 87,98.42 87,94.61 89.53,96.52 92.08,98.42 92.08,94.61 92.08,90.81 98.11,82.55 98.11,63.82
  pour Bottom (isolate 0.813, no thermals): 0,56.2 13.02,56.2 14.61,57.78 14.61,63.18 12.06,65.72 12.06,80.96 12.7,81.6 15.24,81.6 16.51,82.87 16.51,91.12 14.61,93.03 0,93.03 0,100 100,100 100,0 0,0
  pour Top (isolate 0.813, no thermals): 0,100 100,100 100,0 0,0
MD  (via drill 0.5, 0.5 pad 0.3)
  Top 0.2: 21.59,20.48 26.66,25.55 U$1.7 | 76.52,50.8 75.98,51.34 U$24.10
  Top 0.254: X1.7 91.76,21.27 90.81,22.23 v89.22,22.23 | v89.22,17.78 87.15,17.78 86.84,18.1 82.07,18.1 80.96,16.99 80.96,15.56 80.33,14.92 62.23,14.92 60.17,12.86 v45.09,12.86 43.97,12.86 43.66,12.54 23.18,12.54 21.59,14.13 21.59,20.48
  Top 0.305: R7.1 v41.91,16.51 | v89.22,22.23 84.77,22.23 83.82,23.18 83.82,24.77 84.45,25.4 84.45,29.21 78.42,35.24 v78.42,35.72 | v78.42,50.16 77.79,50.8 76.52,50.8
  Bottom 0.305: v89.22,22.23 v89.22,17.78 | v41.91,16.51 41.91,14.61 42.86,13.65 44.45,13.65 45.09,13.02 v45.09,12.86 | v78.42,35.72 78.42,37.78 77.79,38.42 77.79,48.9 78.42,49.53 v78.42,50.16
MDSW  (via drill 0.5)
  Top 0.2: v77.15,51.75 77.15,52.07 76.7,52.52 U$24.9
  Top 0.254: U$82.5 76.04,19.84 77.15,20.95 v79.22,20.95
  Top 0.305: U$82.2 U$82.5 | v79.22,22.86 79.53,22.86 82.87,26.19 82.87,28.89 76.52,35.24 v76.52,35.88
  Bottom 0.305: v79.22,20.95 v79.22,22.86 | v76.52,35.88 76.52,50.94 77.15,51.57 v77.15,51.75
MISOB
  Top 0.2: 34.92,65.72 25.66,56.46 U$1.71
  Top 0.305: X10.6 46.67,73.88 46.67,72.07 43.5,68.9 36.2,68.9 34.92,67.63 34.92,65.72
MOSIB
  Top 0.2: 34.29,66.04 25.16,56.91 U$1.72
  Top 0.305: X10.5 44.13,73.92 44.13,72.07 41.59,69.53 35.88,69.53 34.29,67.94 34.29,66.04
MTCLKA
  Top 0.2: 42.86,34.29 40.96,34.29 40.15,35.1 U$1.31
  Top 0.305: U$10.2 45.09,46.35 44.13,45.4 44.13,35.56 42.86,34.29
MTCLKB/USBDPUPE  (via drill 0.5)
  Top 0.305: JP8.5 53.98,63.18 v48.74,57.94 | v44.45,48.58 U$11.2
  Bottom 0.305: v48.74,57.94 46.35,57.94 44.45,56.04 v44.45,48.58
MTCLKC
  Top 0.2: 42.23,44.61 41.22,43.6 U$1.48
  Top 0.305: U$8.2 46.04,54.93 45.09,53.98 43.5,53.98 42.23,52.7 42.23,44.61
MTCLKD
  Top 0.2: 42.86,44.45 41.51,43.1 U$1.47
  Top 0.305: U$9.2 44.13,53.02 42.86,51.75 42.86,44.45
MTIOC4A  (via drill 0.5)
  Top 0.2: v19.68,49.21 19.68,45.72 20.8,44.6 U$1.76
  Top 0.305: Q4.1 R33.2 15.56,48.26 v15.56,49.21
  Bottom 0.305: v15.56,49.21 v19.68,49.21
N$1
  Top 0.406: JP5.1 JP4.3
N$2
  Top 0.406: JP4.4 JP5.2
N$3
  Top 0.406: R9.2
  Top 0.61: R9.2 JP2.2
N$4
  Top 0.61: JP3.2 R10.1
N$5
  Top 0.305: D1.K 57.49,54.93 arc-90 X8.3
N$6
  Top 0.305: D2.K X8.4
N$7
  Top 0.305: D3.K 53.02,46.35 55.88,43.5 58.74,43.5 59.39,44.15 X7.3
N$8
  Top 0.305: D4.K 54.93,48.58 56.89,46.61 X7.4
N$9  (via drill 0.5 pad 0.3)
  Top 0.305: U$8.1 49.85,54.93 | D1.A 49.85,54.93 | 49.85,54.93 50.16,55.88 50.8,56.52 v53.34,56.52
  Bottom 0.305: v53.34,56.52 R15.1
  Bottom 0.406: R15.1 52.07,54.93 52.63,54.37 C10.2
N$10  (via drill 0.5 pad 0.3)
  Top 0.305: U$9.1 50.16,53.02 | 50.16,53.02 D2.A | v45.4,51.75 49.21,51.75 50.16,52.39 50.16,53.02
  Bottom 0.305: C11.2 46.04,52.39 v45.4,51.75
  Bottom 0.406: R16.1 46.99,52.47 C11.2
N$11  (via drill 0.5 pad 0.3)
  Top 0.305: U$10.1 49.85,46.35 | D3.A 49.85,46.35 | 49.85,46.35 49.85,45.4 50.48,44.77 v53.34,44.77
  Bottom 0.305: v53.34,44.77 R17.1
  Bottom 0.406: R17.1 52.07,46.04 52.63,46.59 C12.2
N$12  (via drill 0.5 pad 0.3)
  Top 0.305: 49.85,48.58 D4.A | U$11.1 49.85,48.58 | 49.85,48.58 49.85,49.21 49.21,49.85 v45.4,49.85
  Bottom 0.305: v45.4,49.85 46.04,49.21 46.99,49.21 C13.2 | R18.1
  Bottom 0.406: R18.1 46.99,49.21 arc-14 C13.2
N$13
  Bottom 0.305: U$58.4 72.08,17.57 R22.2
N$14
  Bottom 0.305: R23.2 68.17,18.95 U$58.2
N$15
  Bottom 0.305: U$58.1 66.15,17.46 65.41,17.46 65.09,17.78 R24.2
N$16
  Bottom 0.254: R22.1
  Bottom 0.305: R22.1 Q1.3
N$17
  Bottom 0.305: R23.1 Q2.3
N$18
  Bottom 0.305: R24.1 Q3.3
N$19
  Top 0.305: LED9.C R34.2
N$20
  Top 0.305: JP7.5 64.45,72.07 65.64,70.89 IC6.22
N$21
  Top 0.2: U$12.15 U$12.16
N$22
  Top 0.61: Q4.3 14.44,43.81 SG2.1
N$23
  Top 0.305: LED1.C R25.2
N$24
  Top 0.305: R26.2 LED2.C
N$25
  Top 0.305: LED3.C R27.2
N$26
  Top 0.305: R28.2 LED4.C
N$27
  Top 0.406: R11.2 LED5.C
N$28
  Top 0.305: JP9.1 R12.1
N$31
  Top 0.2: C1.1 25.4,25.72 25.66,25.98 U$1.5
N$32
  Top 0.2: R1.2 31.43,24.45 30.66,25.22 U$1.15
N$33
  Top 0.305: R35.1 10.48,17.14 10.62,17.29 IC1.2
N$34
  Top 0.254: FT231XS.12 77.47,39.37 77.79,39.05 R40.2
N$35
  Top 0.254: FT231XS.11 76.2,38.71 76.2,37.78 76.52,37.47 R41.2
N$36  (via drill 0.5)
  Top 0.254: C21.2 FT231XS.14 FT231XS.13 v73.34,40.01 | FT231XS.3 v73.34,43.18
  Bottom 0.254: v73.34,43.18 v73.34,40.01
N$37
  Top 0.305: R41.1 85.72,37.47 87.14,38.88 X14.3
  Bottom 0.305: C22.2 87.31,41.44 X14.3
N$38
  Top 0.305: R40.1 84.14,39.05 85.14,40.06 X14.2
  Bottom 0.254: 85.09,41.56 X14.2
  Bottom 0.305: C23.2 85.09,41.56
N$39
  Bottom 0.61: X14.1 85.41,44.38 D7.C 85.39,46.67 U$18.1
N$40  (via drill 0.5)
  Top 0.254: FT231XS.15 77.47,41.27 78.5,42.3 79.69,42.3 C24.1 81.28,42.33 C25.1
  Top 0.305: v82.87,42.23 82.79,42.3 C25.1
  Bottom 0.61: U$18.2 80.65,45.41 80.64,45.4 82.87,43.18 v82.87,42.23
N$41
  Bottom 0.305: SJ1.2 R42.1
N$42
  Bottom 0.305: SJ2.2 R43.1
N$43
  Top 0.305: LED10.C R49.2
N$44
  Top 0.305: R45.1 92.08,57.15 92.38,56.85 U$22.2
N$45
  Top 0.305: R44.1 91.76,55.56 92.39,56.2 U$22.3
N$46
  Top 0.305: R46.1 91.44,59.05 93.05,57.45 U$22.1
N$47
  Top 0.305: LED11.C R50.2
N$49
  Top 0.305: LED12.A 77.15,73.66 76.2,72.71 73.03,72.71 72.25,71.93 IC6.14
N$50
  Top 0.254: C32.1 79.38,66.36
  Top 0.305: 79.45,66.36 79.38,66.36 78.74,66.36 78.27,65.89 IC6.7
N$51
  Top 0.406: IC6.5 IC6.4
N$52
  Top 0.305: X3.3 86.87,72.39 88.58,72.39 89.22,71.75 89.22,70.17 88.27,69.22 80.64,69.22 78.12,66.69 IC6.8
N$53
  Top 0.305: X3.2 80.92,70.44 77.97,67.49 IC6.9
N$54
  Bottom 0.61: X3.1
  Bottom 1.27: X3.1 U$76.1
N$55
  Top 0.305: LED13.A 77.15,75.56 74.93,73.34 72.71,73.34 71.45,72.08 IC6.15
N$56
  Top 0.406: R52.2 LED12.C
N$57
  Top 0.406: LED13.C R53.2
N$58  (via drill 0.5)
  Top 0.254: v67.94,72.71 68.58,72.71 69.05,72.24 IC6.18
  Top 0.305: R54.1 74.61,77.78 JP7.1
  Bottom 0.406: JP7.1 74.61,74.3 73.03,72.71 v67.94,72.71
N$59
  Top 0.305: JP7.4 66.99,73.34 66.65,73 IC6.21
N$60
  Top 0.305: R7.2 LED14.C
N$65
  Top 0.305: U$82.6 U$82.3 45.09,22.82 45.09,24.76 R6.1
P07
  Top 0.2: JP6.2 17.14,28.57 17.46,28.89 R51.1 17.78,29.84 18.73,29.84 19.05,30.16 19.05,33.02 19.63,33.6 U$1.98
P14
  Top 0.2: U$1.32 37.7,35.56 40.32,35.56 40.96,34.92 42.55,34.92
  Top 0.305: 42.55,34.92 43.5,35.88 43.5,49.85 44.45,50.8 59.69,50.8 60.64,51.75 60.64,53.98 57.15,57.47 57.15,64.45 JP8.3
P16
  Top 0.2: 43.18,33.66 40.96,33.66 40.01,34.6 U$1.30
  Top 0.305: 43.18,33.66 44.77,35.24 44.77,40.01 47.62,42.86 59.37,42.86 60.64,44.13 60.64,49.53 63.18,52.07 63.18,53.98 59.69,57.47 59.69,64.45 JP8.4
P22  (via drill 0.5 pad 0.3)
  Top 0.2: U$1.26 37.66,32.27 36.2,30.8 36.2,27.62 36.83,26.99 v38.73,26.99 v38.74,26.99 U$21.7
  Bottom 0.305: S4.4 56.83,8.69 56.83,10.79 55.88,11.75 44.77,11.75 43.5,13.02 39.37,13.02 38.42,13.97 38.42,22.54 39.05,23.18 39.05,26.67 v38.73,26.99
  Bottom 0.61: S4.3 S4.4
P23  (via drill 0.5 pad 0.3)
  Top 0.2: U$1.25 35.66,26.57 36.2,26.04 v38.1,26.04 39.05,26.04 39.46,26.44 U$21.5
  Bottom 0.305: S3.4 44.13,8.69 44.13,11.43 43.18,12.38 39.05,12.38 37.78,13.65 37.78,22.86 38.42,23.5 38.42,25.72 v38.1,26.04
  Bottom 0.61: S3.3 S3.4
P24  (via drill 0.5 pad 0.3)
  Top 0.2: U$1.24 35.16,26.11 36.2,25.08 v37.47,25.08 39.05,25.08 39.91,25.94 U$21.3
  Bottom 0.305: S2.4 31.43,8.69 31.43,11.43 32.07,12.06 35.56,12.06 37.15,13.65 37.15,23.18 37.47,23.5 v37.47,25.08
  Bottom 0.61: S2.3 S2.4
P25  (via drill 0.5 pad 0.3)
  Top 0.2: U$1.23 34.66,25.34 35.88,24.13 v36.51,24.13 v36.52,24.12 36.52,24.13 39.37,24.13 40.24,25 U$21.1
  Bottom 0.305: S1.4 18.73,8.69 18.73,10.48 20,11.75 30.8,11.75 31.75,12.7 35.24,12.7 36.51,13.97 v36.51,24.13
  Bottom 0.61: S1.3 S1.4
PA0
  Top 0.2: 31.43,61.28 26.16,56.01 U$1.70
  Top 0.305: X9.3 39.37,61.91 38.73,61.28 31.43,61.28
PA1
  Top 0.2: 31.75,60.64 26.66,55.55 U$1.69
  Top 0.305: X9.4 40.64,64.45 40.64,61.91 39.37,60.64 31.75,60.64
PA2
  Top 0.2: 32.07,60.01 27.16,55.1 U$1.68
  Top 0.305: X9.5 41.91,61.91 40.01,60.01 32.07,60.01
PA3
  Top 0.2: 32.38,59.37 27.66,54.65 U$1.67
  Top 0.305: X9.6 43.18,64.45 43.18,61.91 40.64,59.37 32.38,59.37
PA4
  Top 0.2: 32.7,58.74 28.16,54.2 U$1.66
  Top 0.305: X9.7 44.45,61.91 41.27,58.74 32.7,58.74
PA5
  Top 0.2: 33.02,58.1 28.66,53.74 U$1.65
  Top 0.305: X9.8 45.72,64.45 45.72,61.91 41.91,58.1 33.02,58.1
PA6
  Top 0.2: 33.34,57.47 29.16,53.29 U$1.64
  Top 0.305: X9.9 46.99,61.91 42.55,57.47 33.34,57.47
PA7
  Top 0.2: 33.66,56.83 29.66,52.84 U$1.63
  Top 0.305: X9.10 48.26,64.45 48.26,61.91 43.18,56.83 33.66,56.83
PB2  (via drill 0.5)
  Top 0.2: 34.61,54.93 32.16,52.48 U$1.58
  Top 0.305: v44.13,88.27 44.13,80.01 44.77,79.38 49.53,79.38 51.44,77.47 51.44,61.91 44.45,54.93 34.61,54.93
  Top 0.406: v26.67,90.49 27.39,91.21 U$12.5
  Bottom 0.305: v26.67,90.49 39.37,90.49 41.59,88.27 v44.13,88.27
PB3  (via drill 0.5 pad 0.3)
  Top 0.2: U$1.57 32.66,50.44 35.24,53.02 38.1,53.02 v38.42,52.7 39.05,52.7 39.6,52.15 U$17.2
  Bottom 0.305: Q3.1 65.87,23.5 63.18,23.5 62.87,23.81 44.45,23.81 42.55,25.72 42.55,32.07 40.64,33.97 39.37,33.97 36.2,37.15 36.2,47.31 38.42,49.53 v38.42,52.7
PB4  (via drill 0.5 pad 0.3)
  Top 0.2: U$1.56 33.16,49.67 35.24,51.75 v37.47,51.75 37.78,51.75 38.1,51.44 38.1,50.48 38.48,50.1 U$17.4
  Bottom 0.305: U$58.3 70.17,15.88 69.53,15.24 65.09,15.24 63.82,16.51 63.82,21.59 62.23,23.18 44.13,23.18 41.91,25.4 41.91,31.75 40.32,33.34 39.05,33.34 35.56,36.83 35.56,47.62 37.47,49.53 v37.47,51.75
PB5  (via drill 0.5 pad 0.3)
  Top 0.2: v36.51,50.8 35.24,50.8 33.66,49.22 U$1.55
  Bottom 0.305: U$58.8 67.63,3.02 R20.2 65.48,4.76 C15.1 65.33,4.76 63.82,4.76 61.28,7.3 61.28,16.83 62.55,18.1 62.55,20.95 61.59,21.91 43.5,21.91 40.64,24.77 40.64,31.11 39.69,32.07 38.42,32.07 34.29,36.2 34.29,48.9 36.2,50.8 v36.51,50.8
PB7  (via drill 0.5 pad 0.3)
  Top 0.2: v36.2,49.53 35.24,49.53 34.66,48.95 U$1.53
  Bottom 0.305: U$58.6 72.71,3.02 R19.2 | C14.1 74.85,4.76 R19.2 | R19.2 71.12,4.76 70.17,5.71 64.45,5.71 61.91,8.26 61.91,16.51 63.18,17.78 63.18,21.27 61.91,22.54 43.81,22.54 41.27,25.08 41.27,31.43 40.01,32.7 38.73,32.7 34.92,36.51 34.92,48.26 v36.2,49.53
PC0  (via drill 0.5 pad 0.3)
  Top 0.2: v37.78,47.62 37.78,48.58 | 37.78,48.58 35.56,48.58 35.16,48.18 U$1.52 | 37.78,48.58 37.78,49.21 38.17,49.6 U$17.6
  Bottom 0.305: Q2.1 69.53,24.13 69.22,24.45 44.77,24.45 43.18,26.04 43.18,32.38 40.96,34.61 39.69,34.61 36.83,37.47 36.83,46.67 v37.78,47.62
PC1  (via drill 0.5 pad 0.3)
  Top 0.2: U$1.51 37.54,46.6 v37.78,46.35 38.42,46.35 39.6,47.54 U$17.8
  Bottom 0.305: Q1.1 73.03,24.13 72.07,25.08 45.09,25.08 43.81,26.35 43.81,32.7 41.27,35.24 40.01,35.24 37.47,37.78 37.47,46.04 v37.78,46.35
PC7  (via drill 0.5 pad 0.3)
  Top 0.2: v42.23,42.7 41.62,42.1 U$1.45
  Top 0.254: X1.10 95.57,20 | R8.2 71.75,20.64
  Top 0.305: 95.57,20 92.08,20 91.76,20.32 83.82,20.32 82.23,21.91 77.15,21.91 75.88,20.64 71.75,20.64 65.72,20.64 60.64,25.72 60.64,26.67 | 60.64,26.67 60.64,30.8 60.01,31.43 v59.05,31.43 | JP9.2 53.34,28.57 55.24,26.67 60.64,26.67
  Bottom 0.305: v59.05,31.43 57.15,31.43 49.69,38.89 46.04,38.89 v42.23,42.7
PD6
  Top 0.2: 16.83,44.45 18.68,42.6 U$1.80
  Top 0.254: LED4.A 16.83,50.26 16.83,44.45
PD7
  Top 0.2: 17.46,44.77 19.13,43.1 U$1.79
  Top 0.254: LED3.A 17.14,52.39 17.46,52.07 17.46,44.77
PE0
  Top 0.2: 18.1,45.09 19.58,43.6 U$1.78
  Top 0.254: LED2.A 17.46,53.98 18.1,53.34 18.1,45.09
PE1
  Top 0.2: 18.73,45.4 20.04,44.1 U$1.77
  Top 0.254: LED1.A 17.46,55.56 18.73,54.29 18.73,45.4
PE3
  Top 0.2: LED9.A 21.91,46.99 22.3,46.6 U$1.75
RES#  (via drill 0.5)
  Top 0.2: v78.11,55.56 76.52,55.56 75.98,55.02 U$24.6 | v26.99,22.86 26.99,23.34 28.16,24.51 U$1.10 | v13.65,12.7 13.65,10.95
  Top 0.254: R35.2 10.48,12.38 11.91,10.95 13.65,10.95 60.64,10.95 62.23,12.54 80.96,12.54 81.92,13.49 81.92,16.19 82.55,16.83 85.57,16.83 86.36,16.03 v88.42,16.03 89.38,16.03 91.76,13.65 X1.13
  Top 0.305: v88.42,21.27 84.3,21.27 83.03,22.54 83.03,25.24 83.66,25.88 83.66,29.05 77.47,35.24 v77.47,36.51
  Bottom 0.305: v88.42,16.03 v88.42,21.27 | v77.47,36.51 77.47,37.78 77.15,38.1 77.15,50.16 78.11,51.12 v78.11,55.56 | v26.99,22.86 15.24,22.86 13.65,21.27 v13.65,12.7
RESETSW  (via drill 0.5)
  Top 0.2: 77.15,53.98 76.7,53.52 U$24.7
  Top 0.254: v77.79,13.34 62.23,13.34 60.33,11.43 21.27,11.43 19.72,12.98 S5.2 | v77.15,54.61 77.15,53.98
  Top 0.305: v75.56,36.83 75.56,35.24 82.07,28.73 82.07,26.51 79.38,23.81 78.11,23.81 75.72,21.43 v75.25,21.43
  Top 0.61: S5.1 S5.2
  Bottom 0.305: v77.15,54.61 76.52,54.61 75.88,53.98 75.88,37.15 v75.56,36.83 | v75.25,21.43 75.25,20.64 75.56,20 75.56,16.51 77.79,14.29 v77.79,13.34
RSPCKB
  Top 0.2: 33.66,66.36 24.66,57.37 U$1.73
  Top 0.305: X10.4 41.59,73.96 41.59,72.07 39.69,70.17 35.56,70.17 33.66,68.26 33.66,66.36
RXD0  (via drill 0.5 pad 0.3)
  Top 0.2: v44.77,30.48 44.77,31.11 44.13,31.75 40.96,31.75 39.61,33.1 U$1.27
  Bottom 0.305: JP4.1 81.28,2.86 78.74,5.4 78.74,14.45 76.2,16.99 76.2,24.13 74.3,25.72 45.4,25.72 44.45,26.67 44.45,30.16 v44.77,30.48
RXD1  (via drill 0.5, 0.5 pad 0.3)
  Top 0.2: 38.1,20 33.16,24.94 U$1.20 33.16,34.75 33.66,35.24 v33.97,35.24 | v38.1,29.21 39.05,29.21 39.46,28.8 U$23.3 | v80.33,48.42 79.85,48.9 78.42,48.9 77.74,49.58 U$25.6
  Top 0.254: X1.11 92.23,16.19 90.96,17.46 v90.96,19.53 81.44,19.53 78.26,16.35 61.28,16.35 59.69,14.76 39.85,14.76 38.1,16.51 38.1,20
  Top 0.305: v80.49,35.88 80.49,35.08 86.2,29.37 v86.2,28.1
  Bottom 0.305: v38.1,29.21 37.78,28.89 34.29,28.89 33.02,30.16 33.02,34.92 33.34,35.24 v33.97,35.24 | v80.33,48.42 79.85,48.42 79.38,47.94 79.38,45.24 79.06,44.93 79.06,38.89 80.49,37.47 v80.49,35.88 | v86.2,28.1 89.69,28.1 90.96,26.83 v90.96,19.53
RXD2  (via drill 0.5 pad 0.3)
  Top 0.2: v41.91,40.01 41.31,40.6 U$1.42
  Bottom 0.305: X5.3 59.37,28.24 59.37,27.3 59.05,26.99 55.88,26.99 54.93,27.94 54.93,31.75 49.05,37.62 45.09,37.62 42.7,40.01 v41.91,40.01
RXD3/FT231TXD  (via drill 0.5)
  Top 0.2: 79.53,47.94 79.06,48.42 78.11,48.42 77.45,49.08 U$25.7
  Top 0.254: 79.53,47.94 79.53,45.56 78.74,44.77 76.54,44.77 FT231XS.20 72.39,44.45 v72.07,44.77
  Bottom 0.254: JP8.6 58.42,60.96 59.05,60.33 61.28,60.33 65.41,56.2 65.41,49.53 70.17,44.77 v72.07,44.77
RXD5  (via drill 0.5 pad 0.3)
  Top 0.2: v41.27,46.67 39.37,46.67 37.66,44.97 U$1.50
  Bottom 0.305: X6.3 59.37,36.53 58.1,37.78 53.02,37.78 50.48,40.16 46.99,40.16 43.18,43.97 43.18,45.4 41.91,46.67 v41.27,46.67
RXD6
  Top 0.2: 33.97,56.2 30.66,52.89 U$1.61
  Top 0.305: 33.97,56.2 43.81,56.2 49.53,61.91 49.53,77.47 48.9,78.11 43.5,78.11 40.32,81.28 40.32,83.19 41.15,84.01 U$12.14
SBDBTMD
  Top 0.2: IC6.43 73.05,57.92 73.03,57.78 73.03,53.82 72.73,53.52 U$24.2
SBDBTRESET
  Top 0.2: U$24.4 73.16,52.52 73.5,52.86 73.5,57.31 73.85,57.66 IC6.44
  Top 0.254: IC6.44 73.98,59.16
SBDBTRX  (via drill 0.5)
  Top 0.2: v74.61,50.8 74.93,51.12 74.93,56.83 77.63,59.53 77.63,62.07 77.01,62.69 IC6.3 | v72.71,50.8 73.03,50.48 73.03,49.53 72.57,49.08 U$25.2
  Bottom 0.2: v74.61,50.8 v72.71,50.8
SBDBTSW0  (via drill 0.5)
  Top 0.2: R5.2 70.64,49.21 71.01,49.58 U$25.1 71.44,50.12 v71.44,50.48 | U$25.5 71.44,47.04 v71.44,46.67 | v71.6,55.4 72.07,55.88 72.07,57.78 71.45,58.41 IC6.41
  Bottom 0.305: v71.44,46.67 v71.44,50.48 68.9,50.48 67.94,51.44 67.94,54.61 68.58,55.24 71.44,55.24 v71.6,55.4
SBDBTSW1
  Top 0.2: IC6.1 75.56,61 75.56,58.74 73.98,57.15 73.98,52.39 73.61,52.02 U$24.5 70.22,52.02 R2.2 69.85,53.66 70.22,54.02 U$24.1
SBDBTTX
  Top 0.2: IC6.2 75.67,61.91 76.83,61.91 77.15,61.59 77.15,59.69 74.45,56.99 74.45,52.23 73.66,51.44 73.66,48.58 73.16,48.08 U$25.4
SCL0  (via drill 0.5 pad 0.3)
  Top 0.2: v42.7,36.51 42.62,36.6 U$1.34
  Top 0.305: v47.31,34.29 67.63,34.29 69.22,32.7 69.22,30.48 70.17,29.53 74.3,29.53 75.56,28.26 X4.3
  Bottom 0.305: v42.7,36.51 43.02,36.51 43.34,36.2 43.34,35.24 44.29,34.29 v47.31,34.29 | X4.3 75.56,28.57 SJ1.1
SDA0  (via drill 0.5 pad 0.3)
  Top 0.2: v41.91,35.72 41.53,36.1 U$1.33
  Top 0.305: v46.35,33.34 67.31,33.34 68.26,32.38 68.26,30.16 70.17,28.26 X4.4
  Bottom 0.305: v41.91,35.72 44.29,33.34 v46.35,33.34 | SJ2.1 73.03,28.26 X4.4
SSLB0
  Top 0.2: 33.02,66.67 24.16,57.82 U$1.74
  Top 0.305: X10.3 39.05,73.96 39.05,72.07 37.78,70.8 35.24,70.8 33.02,68.58 33.02,66.67
TCK  (via drill 0.5 pad 0.3)
  Top 0.2: 38.73,20 33.66,25.07 U$1.21 33.66,31.43 | v38.73,30.16 39.06,30.16 39.92,29.3 U$23.5 | 33.66,31.43 | v34.61,34.29 34.29,34.29 33.66,33.66 33.66,31.43
  Top 0.254: v80.17,19.53 79.53,18.89 63.02,18.89 59.37,15.24 40.16,15.24 38.73,16.67 38.73,20
  Top 0.305: X1.1 93.66,28.89 89.85,25.08 v89.06,25.08
  Bottom 0.305: v89.06,25.08 87.31,25.08 86.68,24.45 86.68,20.32 85.88,19.53 v80.17,19.53 | v38.73,30.16 37.78,30.16 37.15,29.53 34.61,29.53 33.66,30.48 33.66,33.66 34.29,34.29 v34.61,34.29
TMS  (via drill 0.5 pad 0.3)
  Top 0.2: 37.47,20 32.66,24.8 U$1.19 32.66,35.84 33.02,36.2 v33.34,36.2 | 39.92,28.26 U$23.1 v38.74,28.25 v38.73,28.26
  Top 0.254: X1.9 v92.08,18.73 | v90.01,18.73 81.44,18.73 78.58,15.88 61.59,15.88 60.01,14.29 39.53,14.29 37.47,16.35 37.47,20
  Bottom 0.254: v92.08,18.73 v90.01,18.73
  Bottom 0.305: v38.73,28.26 33.97,28.26 32.38,29.84 32.38,35.56 33.02,36.2 v33.34,36.2
TRST#  (via drill 0.5 pad 0.3)
  Top 0.2: 36.83,20 31.16,25.67 U$1.16
  Top 0.254: v80.17,16.19 79.38,15.4 61.91,15.4 60.33,13.81 39.21,13.81 36.83,16.19 36.83,20
  Top 0.305: X1.3 93.66,26.35 91.44,24.13 87.31,24.13 | 87.31,24.13 v85.72,24.13 | R4.2 87.31,24.13
  Bottom 0.254: 79.06,19.53 79.06,17.3 v80.17,16.19
  Bottom 0.305: v85.72,24.13 83.66,24.13 79.06,19.53
TXD0  (via drill 0.5 pad 0.3)
  Top 0.2: v45.72,31.43 45.72,32.07 45.4,32.38 40.96,32.38 39.74,33.6 U$1.28
  Bottom 0.305: JP4.2 80.64,5.4 79.38,6.67 79.38,14.76 76.83,17.3 76.83,24.45 74.93,26.35 45.72,26.35 45.09,26.99 45.09,29.21 45.72,29.84 v45.72,31.43
TXD1  (via drill 0.5, 0.5 pad 0.3)
  Top 0.2: 39.37,20 34.16,25.21 U$1.22 34.16,32.89 34.61,33.34 v35.24,33.34 | v39.37,31.11 40.24,30.25 U$23.7 | v78.58,46.04 76.83,46.04 75.98,46.9 U$25.10
  Top 0.254: X1.5 93.66,23.81 93.03,23.18 v85.25,23.18 | v82.07,20.8 80.17,20.8 78.74,19.37 62.71,19.37 59.05,15.72 40.48,15.72 39.37,16.83 39.37,20
  Top 0.305: v79.38,36.2 79.38,35.24 85.25,29.37 85.25,25.24 84.61,24.61 84.61,23.81 v85.25,23.18
  Bottom 0.305: v85.25,23.18 85.25,21.11 84.45,20.32 82.55,20.32 v82.07,20.8 | v39.37,31.11 37.47,31.11 36.51,30.16 34.92,30.16 34.29,30.8 34.29,33.02 34.61,33.34 v35.24,33.34 | v78.58,46.04 78.58,45.88 78.42,45.72 78.42,38.58 79.38,37.62 v79.38,36.2
TXD2  (via drill 0.5 pad 0.3)
  Top 0.2: v42.55,40.96 41.9,41.6 U$1.44
  Bottom 0.305: X5.4 56.83,28.32 56.83,30.8 49.37,38.26 45.72,38.26 43.02,40.96 v42.55,40.96
TXD3/FT231RXD
  Top 0.2: 43.81,33.02 40.96,33.02 39.88,34.1 U$1.29
  Top 0.254: 66.04,40.96 67.63,42.55 69.22,42.55 | FT231XS.4 69.22,42.55 | 69.22,42.55 69.22,44.77 70.17,45.72 73.34,45.72 73.66,46.04 73.66,47.31 74.43,48.08 U$25.9
  Top 0.305: 43.81,33.02 46.04,35.24 52.07,35.24 57.78,40.96 66.04,40.96
TXD5  (via drill 0.5 pad 0.3)
  Top 0.2: v41.27,45.4 41.27,44.77 40.61,44.1 U$1.49
  Bottom 0.305: X6.4 53.02,36.51 50.01,39.53 46.67,39.53 42.39,43.81 42.39,44.93 41.91,45.4 v41.27,45.4
TXD6
  Top 0.2: 34.29,55.56 31.66,52.94 U$1.59
  Top 0.305: 41.91,82.75 U$12.13 41.98,80.9 44.13,78.74 49.21,78.74 50.48,77.47 50.48,61.91 44.13,55.56 34.29,55.56
USB0_DM  (via drill 0.5, 0.5 pad 0.3)
  Top 0.2: v41.91,37.31 41.75,37.15 40.01,37.15 39.55,37.6 U$1.36
  Top 0.305: v45.72,36.04 51.91,36.04 57.47,41.59 65.41,41.59 67.31,43.5 67.31,52.39 v66.36,53.34 | v87.31,57.15 R45.2
  Bottom 0.305: v41.91,37.31 43.18,37.31 44.45,36.04 v45.72,36.04 | v66.36,53.34 66.36,55.88 67.63,57.15 v87.31,57.15
USB0_DP  (via drill 0.5, 0.5 pad 0.3)
  Top 0.2: U$1.37 v41.12,38.1
  Top 0.305: v46.67,36.83 51.75,36.83 57.15,42.23 64.77,42.23 66.36,43.81 v66.36,52.07 | v87.63,53.98 R48.2 R44.2
  Bottom 0.305: v41.12,38.1 43.34,38.1 44.61,36.83 v46.67,36.83 | v66.36,52.07 66.67,52.07 67.31,52.7 67.31,55.88 67.94,56.52 81.6,56.52 84.14,53.98 v87.63,53.98
USB0VBUS  (via drill 0.5)
  Top 0.305: R47.1 R46.2 | R47.1 87.55,59.13 C27.2 | v84.14,59.05 85.41,57.78 86.68,57.78 87.63,58.74 R47.1
  Bottom 0.305: JP8.2 59.69,68.26 69.53,58.42 81.28,58.42 81.92,59.05 v84.14,59.05
USBDPUPE  (via drill 0.5)
  Top 0.305: v83.66,58.1 83.66,56.83 84.93,55.56 R48.1
  Bottom 0.305: JP8.1 57.15,66.99 60.01,66.99 69.22,57.78 83.34,57.78 v83.66,58.1
XCIN
  Top 0.2: 23.18,21.27 27.16,25.26 U$1.8
  Top 0.254: C4.2 22.94,17.1 U$3.1 23.18,17.59 23.18,21.27
XCOUT
  Top 0.2: U$3.2 27.62,17.59 27.62,20 26.04,21.59 26.04,23.18 27.66,24.8 U$1.9
  Top 0.254: U$3.2 27.86,17.1 C5.2
XTAL
  Top 0.2: 27.94,23.34 28.66,24.06 U$1.11
  Top 0.254: C2.1 30.03,15.47 XTAL1.1 29.21,16.83 28.57,17.46 28.57,20 27.94,20.64 27.94,23.34

## Text on the board
tPlace: 12VDC | CAN0 | CAN1 | BT1 | BT2 | 1 | BOOT | ENCODER0 | ENCODER1 | BOOT | @NIT ROBOCON STDUIO | RESET | W | NHK2016Mother_rev4 | SW0 | SW1 | SW2 | SW3 | BT0